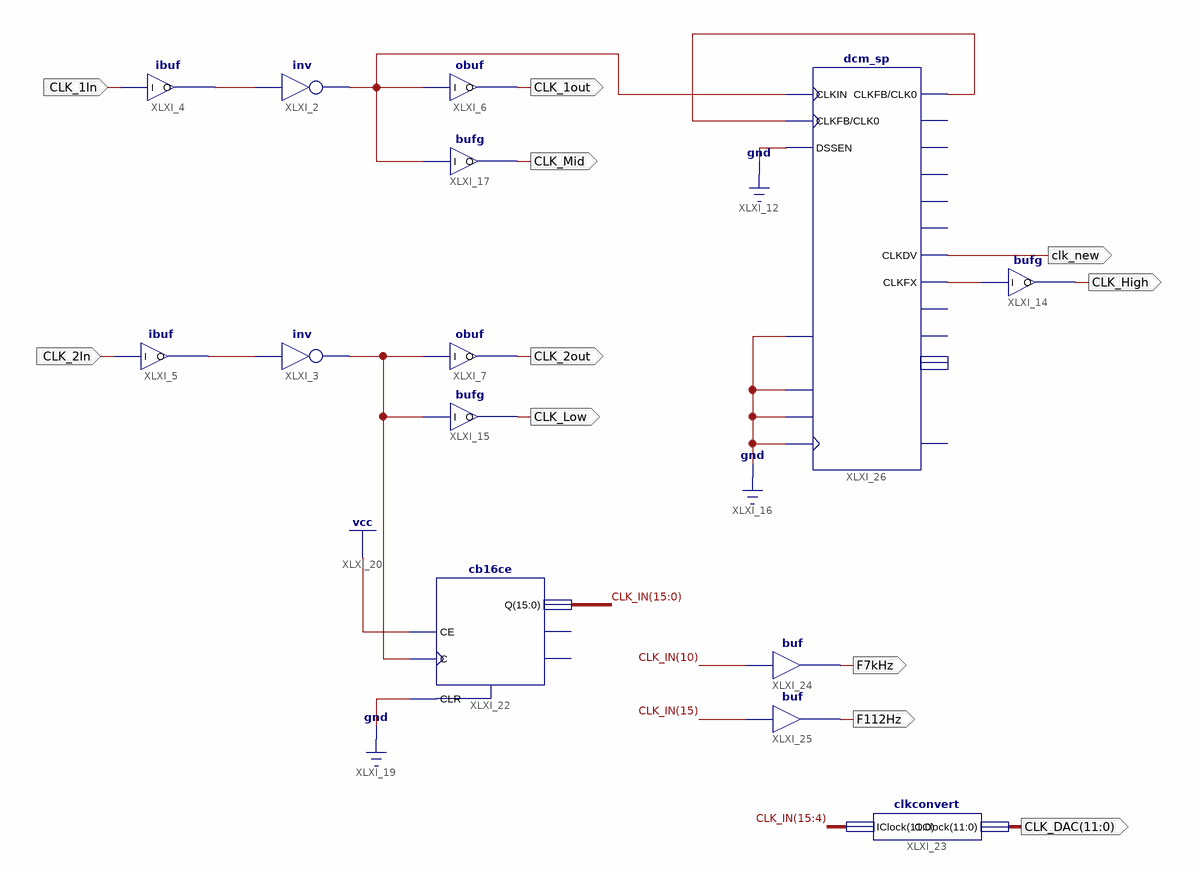
[diagram p0: schematic sheet 1]
// Xilinx ISE schematic ClockSystem.sch (spartan6) as structural Verilog: 14 symbols, 11 ports
module ClockSystem (
  input  CLK_1In,
  input  CLK_2In,
  output CLK_1out,
  output CLK_2out,
  output CLK_Low,
  output CLK_High,
  output CLK_Mid,
  output [11:0] CLK_DAC,
  output F7kHz,
  output F112Hz,
  output clk_new
);

  wire XLXN_1, XLXN_5, XLXN_6, XLXN_14, XLXN_15, XLXN_16;
  wire [15:0] CLK_IN;

  ibuf XLXI_4 (.I(CLK_1In), .O(XLXN_5));
  ibuf XLXI_5 (.I(CLK_2In), .O(XLXN_6));
  not XLXI_2 (XLXN_1, XLXN_5);
  not XLXI_3 (XLXN_15, XLXN_6);
  obuf XLXI_6 (.I(XLXN_1), .O(CLK_1out));
  obuf XLXI_7 (.I(XLXN_15), .O(CLK_2out));
  bufg XLXI_14 (.I(XLXN_16), .O(CLK_High));
  bufg XLXI_15 (.I(XLXN_15), .O(CLK_Low));
  bufg XLXI_17 (.I(XLXN_1), .O(CLK_Mid));
  cb16ce XLXI_22 (.C(XLXN_15), .CE(1'b1), .CLR(1'b0), .Q(CLK_IN));  // open: CEO, TC
  clkconvert XLXI_23 (.IClock(CLK_IN[15:4]), .OClock(CLK_DAC));
  buf XLXI_24 (F7kHz, CLK_IN[10]);
  buf XLXI_25 (F112Hz, CLK_IN[15]);
  dcm_sp #(.CLKFX_MULTIPLY(5)) XLXI_26 (
    .CLKFB(XLXN_14), .CLKIN(XLXN_1), .DSSEN(1'b0), .PSCLK(1'b0), .PSEN(1'b0), .PSINCDEC(1'b0), .RST(1'b0),
    .CLK0(XLXN_14), .CLKDV(clk_new), .CLKFX(XLXN_16));  // open: CLK180, CLK270, CLK2X, CLK2X180, CLK90, CLKFX180, LOCKED, PSDONE, STATUS
endmodule
